# EAGLE schematic display (EAGLE 4.16)
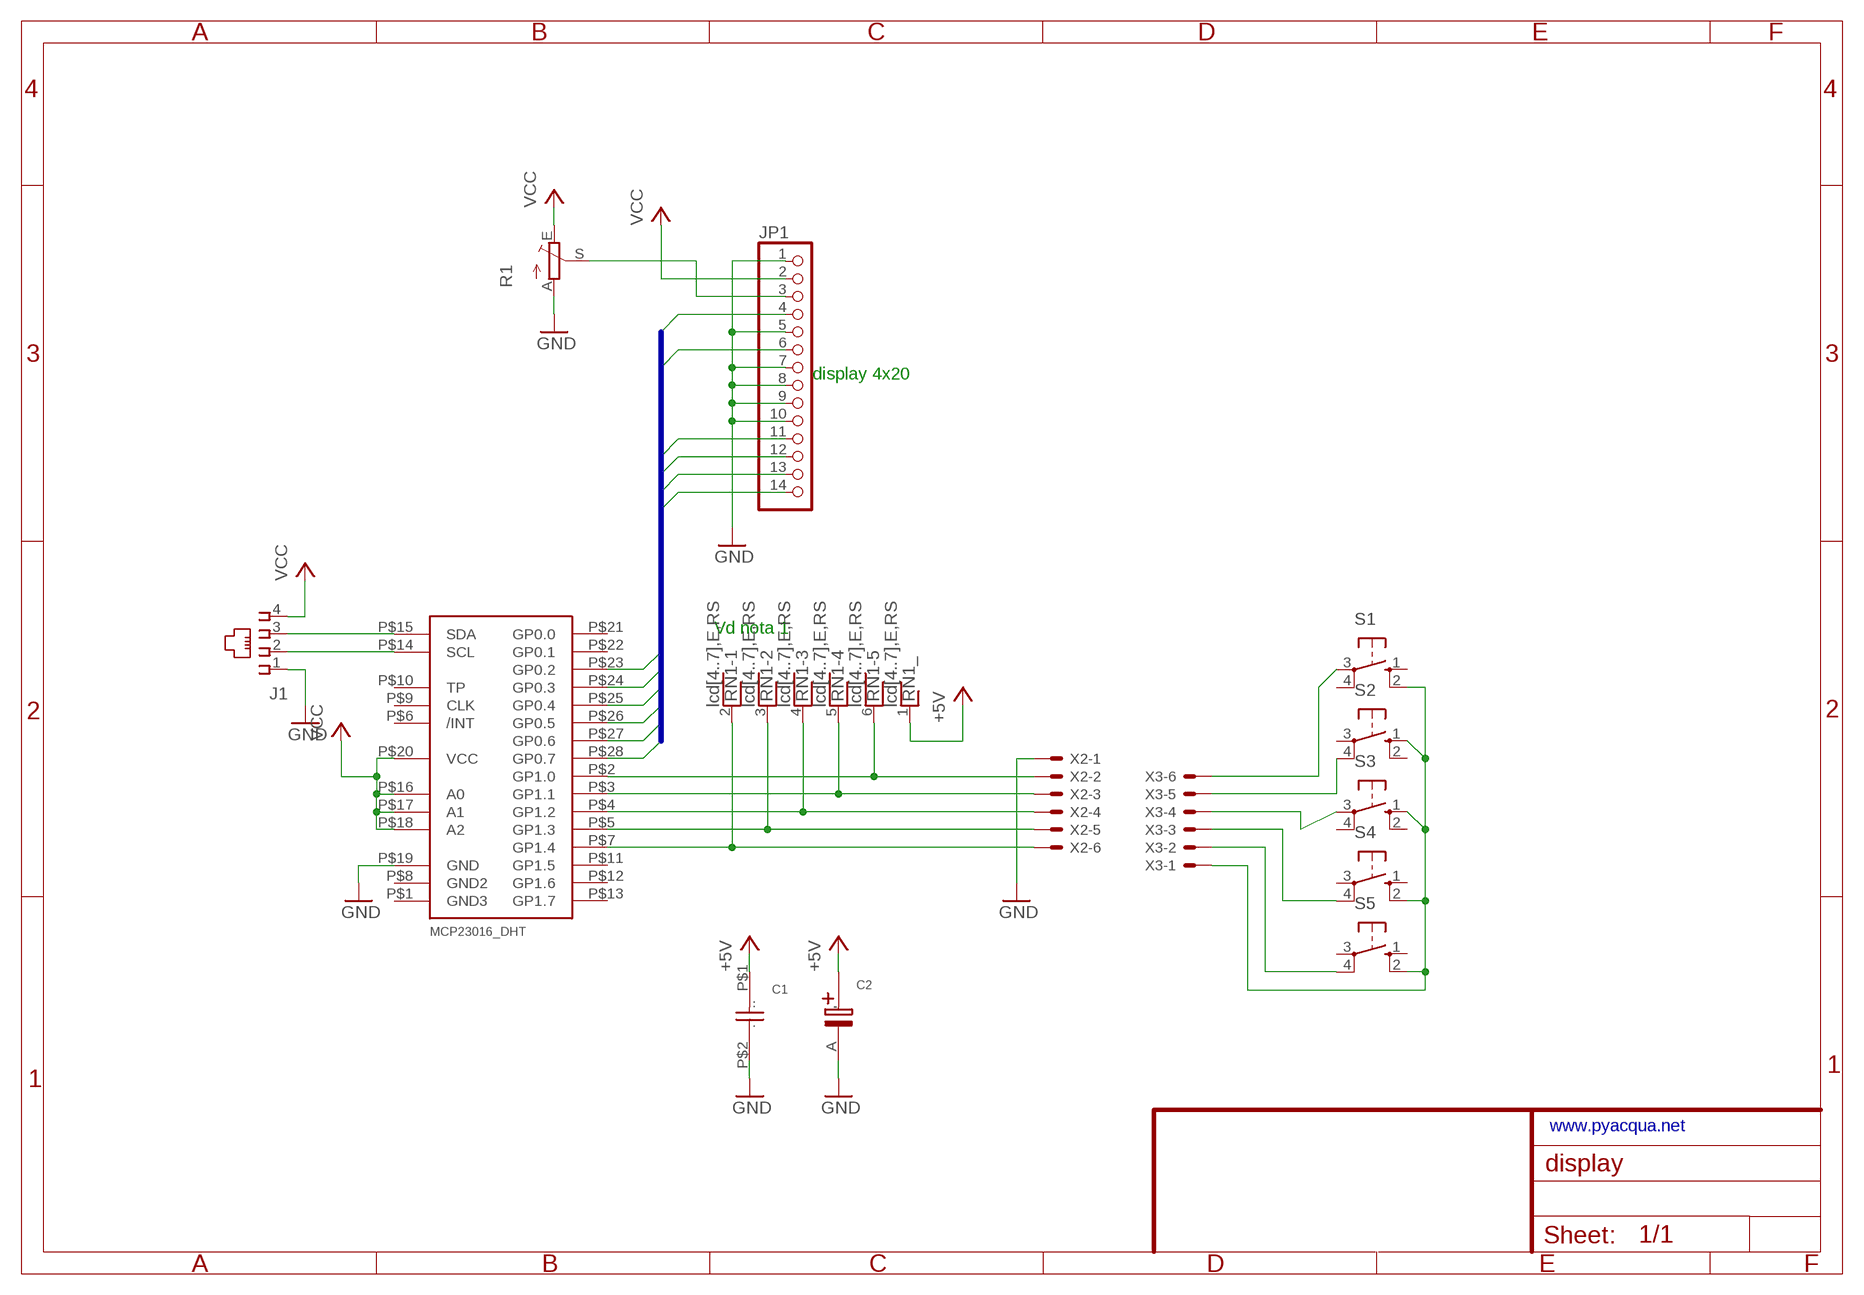
[diagram p0: schematic, sheet 1]

## Parts
C1  CAP_POLI  [CAP_POLI]
C2  CAP_ELET  [CAP_ELET]
J1  215876-6  [215876-6]
JP1  PINHD-1X14  [1X14]
R1  TRIM_EU-LI10  [LI10]
RN1  lcd[4..7],E,RS  RNX5  [RN-6]
S1  10-XX  [B3F-10XX]
S2  10-XX  [B3F-10XX]
S3  10-XX  [B3F-10XX]
S4  10-XX  [B3F-10XX]
S5  10-XX  [B3F-10XX]
U$1  MCP23016_DHT  [MCP23016_DHT]
X2  22-23-2061  [22-23-2061]
X3  22-23-2061  [22-23-2061]

## Nets
+5V: C1.P$1(.) C2.B(.) RN1.1
D4: JP1.11 U$1.P$25(GP0.4)
D5: JP1.12 U$1.P$26(GP0.5)
D6: JP1.13 U$1.P$27(GP0.6)
D7: JP1.14 U$1.P$28(GP0.7)
E: JP1.6 U$1.P$24(GP0.3)
GND: C1.P$2(..) C2.A(') J1.1 JP1.1 JP1.5 JP1.7 JP1.8 JP1.9 JP1.10 R1.A U$1.P$19(GND) X2.1
N$1: S1.2(S1) S2.1(S) S3.1(S) S4.2(S1) S5.2(S1) X3.1
N$2: J1.2 U$1.P$14(SCL)
N$3: J1.3 U$1.P$15(SDA)
N$5: S5.4(P1) X3.2
N$6: S4.4(P1) X3.3
N$7: S3.3(P) X3.4
N$8: S2.4(P1) X3.5
N$9: S1.3(P) X3.6
N$10: JP1.3 R1.S
N$23: RN1.6 U$1.P$2(GP1.0) X2.2
N$30: RN1.5 U$1.P$3(GP1.1) X2.3
N$44: RN1.4 U$1.P$4(GP1.2) X2.4
N$45: RN1.3 U$1.P$5(GP1.3) X2.5
N$46: RN1.2 U$1.P$7(GP1.4) X2.6
RS: JP1.4 U$1.P$23(GP0.2)
VCC: J1.4 JP1.2 R1.E U$1.P$16(A0) U$1.P$17(A1) U$1.P$18(A2) U$1.P$20(VCC)
Unconnected: S1.1(S) S1.4(P1) S2.2(S1) S2.3(P) S3.2(S1) S3.4(P1) S4.1(S) S4.3(P) S5.1(S) S5.3(P) U$1.P$6(/INT) U$1.P$9(CLK) U$1.P$10(TP) U$1.P$11(GP1.5) U$1.P$12(GP1.6) U$1.P$13(GP1.7) U$1.P$21(GP0.0) U$1.P$22(GP0.1)

## Buses
D[4..7],E,RS

## Notes on the sheet
- display 4x20
- Vd nota 1
- www.pyacqua.net

## Power pins joined to a net without a drawn wire
GND2: U$1.P$8(GND2)
GND3: U$1.P$1(GND3)

## Library data of the parts
C1 = aggiunte:CAP_POLI: Condensatore non elett passo 5.08 mm (2 x 2.54)
C2 = aggiunte:CAP_ELET: Condensatore elett. passo 2.54 mm
J1 = con-amp:215876-6: AMP connector
JP1 = pinhead:PINHD-1X14: PIN HEADER
R1 = pot:TRIM_EU-: POTENTIOMETER
RN1 = resistor-net:RNX5: RESISTOR NETWORK
S1-S5 = switch-omron:10-XX: OMRON SWITCH
U$1 = aggiunte:MCP23016_DHT: MCP23016 I2C expander a 16 bit
X2 X3 = con-molex:22-23-2061: .100" (2.54mm) Center Header - 6 Pin